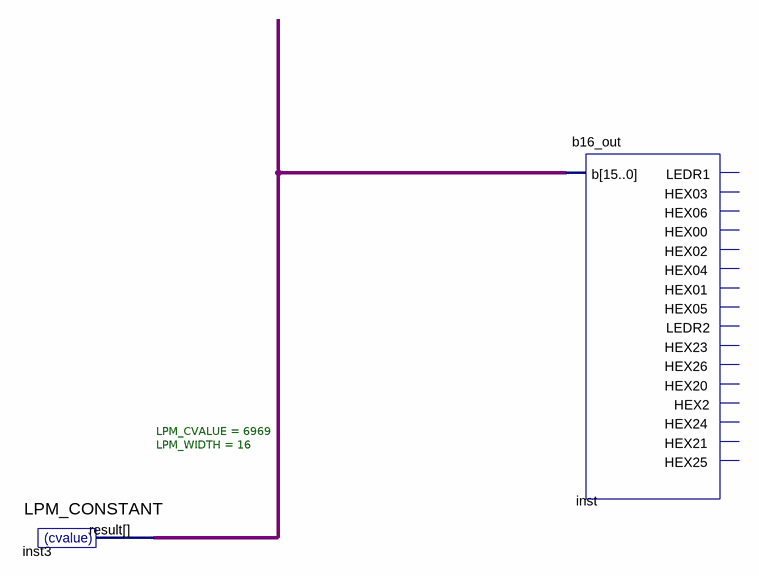
[diagram p0: schematic sheet]
// Quartus schematic output_test.bdf as structural Verilog: 2 symbols, 0 pins
module output_test (
);

  wire [15:0] inst3_result;

  LPM_CONSTANT #(.LPM_CVALUE(6969), .LPM_WIDTH(16)) inst3 (.result(inst3_result));
  b16_out inst (.b(inst3_result));  // open: LEDR1, HEX03, HEX06, HEX00, HEX02, HEX04, HEX01, HEX05, LEDR2, HEX23, HEX26, HEX20, HEX2, HEX24, HEX21, HEX25
endmodule
